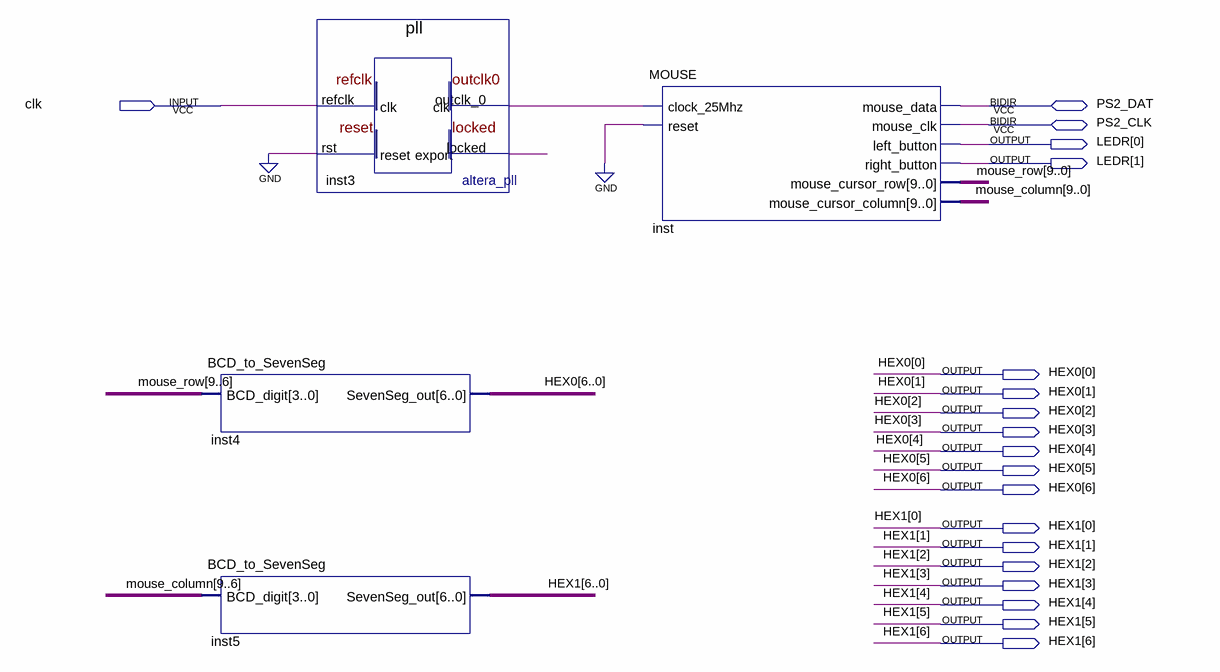
[diagram p0: schematic sheet]
// Quartus schematic ps2.bdf as structural Verilog: 4 symbols, 19 pins
module ps2 (
  input  clk,
  inout  PS2_DAT,
  inout  PS2_CLK,
  output [1:0] LEDR,
  output [6:0] HEX0,
  output [6:0] HEX1
);

  wire inst3_locked, inst3_outclk_0;
  wire [9:0] mouse_column, mouse_row;

  BCD_to_SevenSeg inst4 (.BCD_digit(mouse_row[9:6]), .SevenSeg_out(HEX0));
  BCD_to_SevenSeg inst5 (.BCD_digit(mouse_column[9:6]), .SevenSeg_out(HEX1));
  pll inst3 (.refclk(clk), .rst(1'b0), .outclk_0(inst3_outclk_0), .locked(inst3_locked));
  MOUSE inst (
    .clock_25Mhz(inst3_outclk_0), .reset(1'b0), .left_button(LEDR[0]), .right_button(LEDR[1]),
    .mouse_cursor_row(mouse_row), .mouse_cursor_column(mouse_column), .mouse_data(PS2_DAT),
    .mouse_clk(PS2_CLK));
endmodule
